# Altium schematic sheet STM32&ESP.SchDoc
size A3
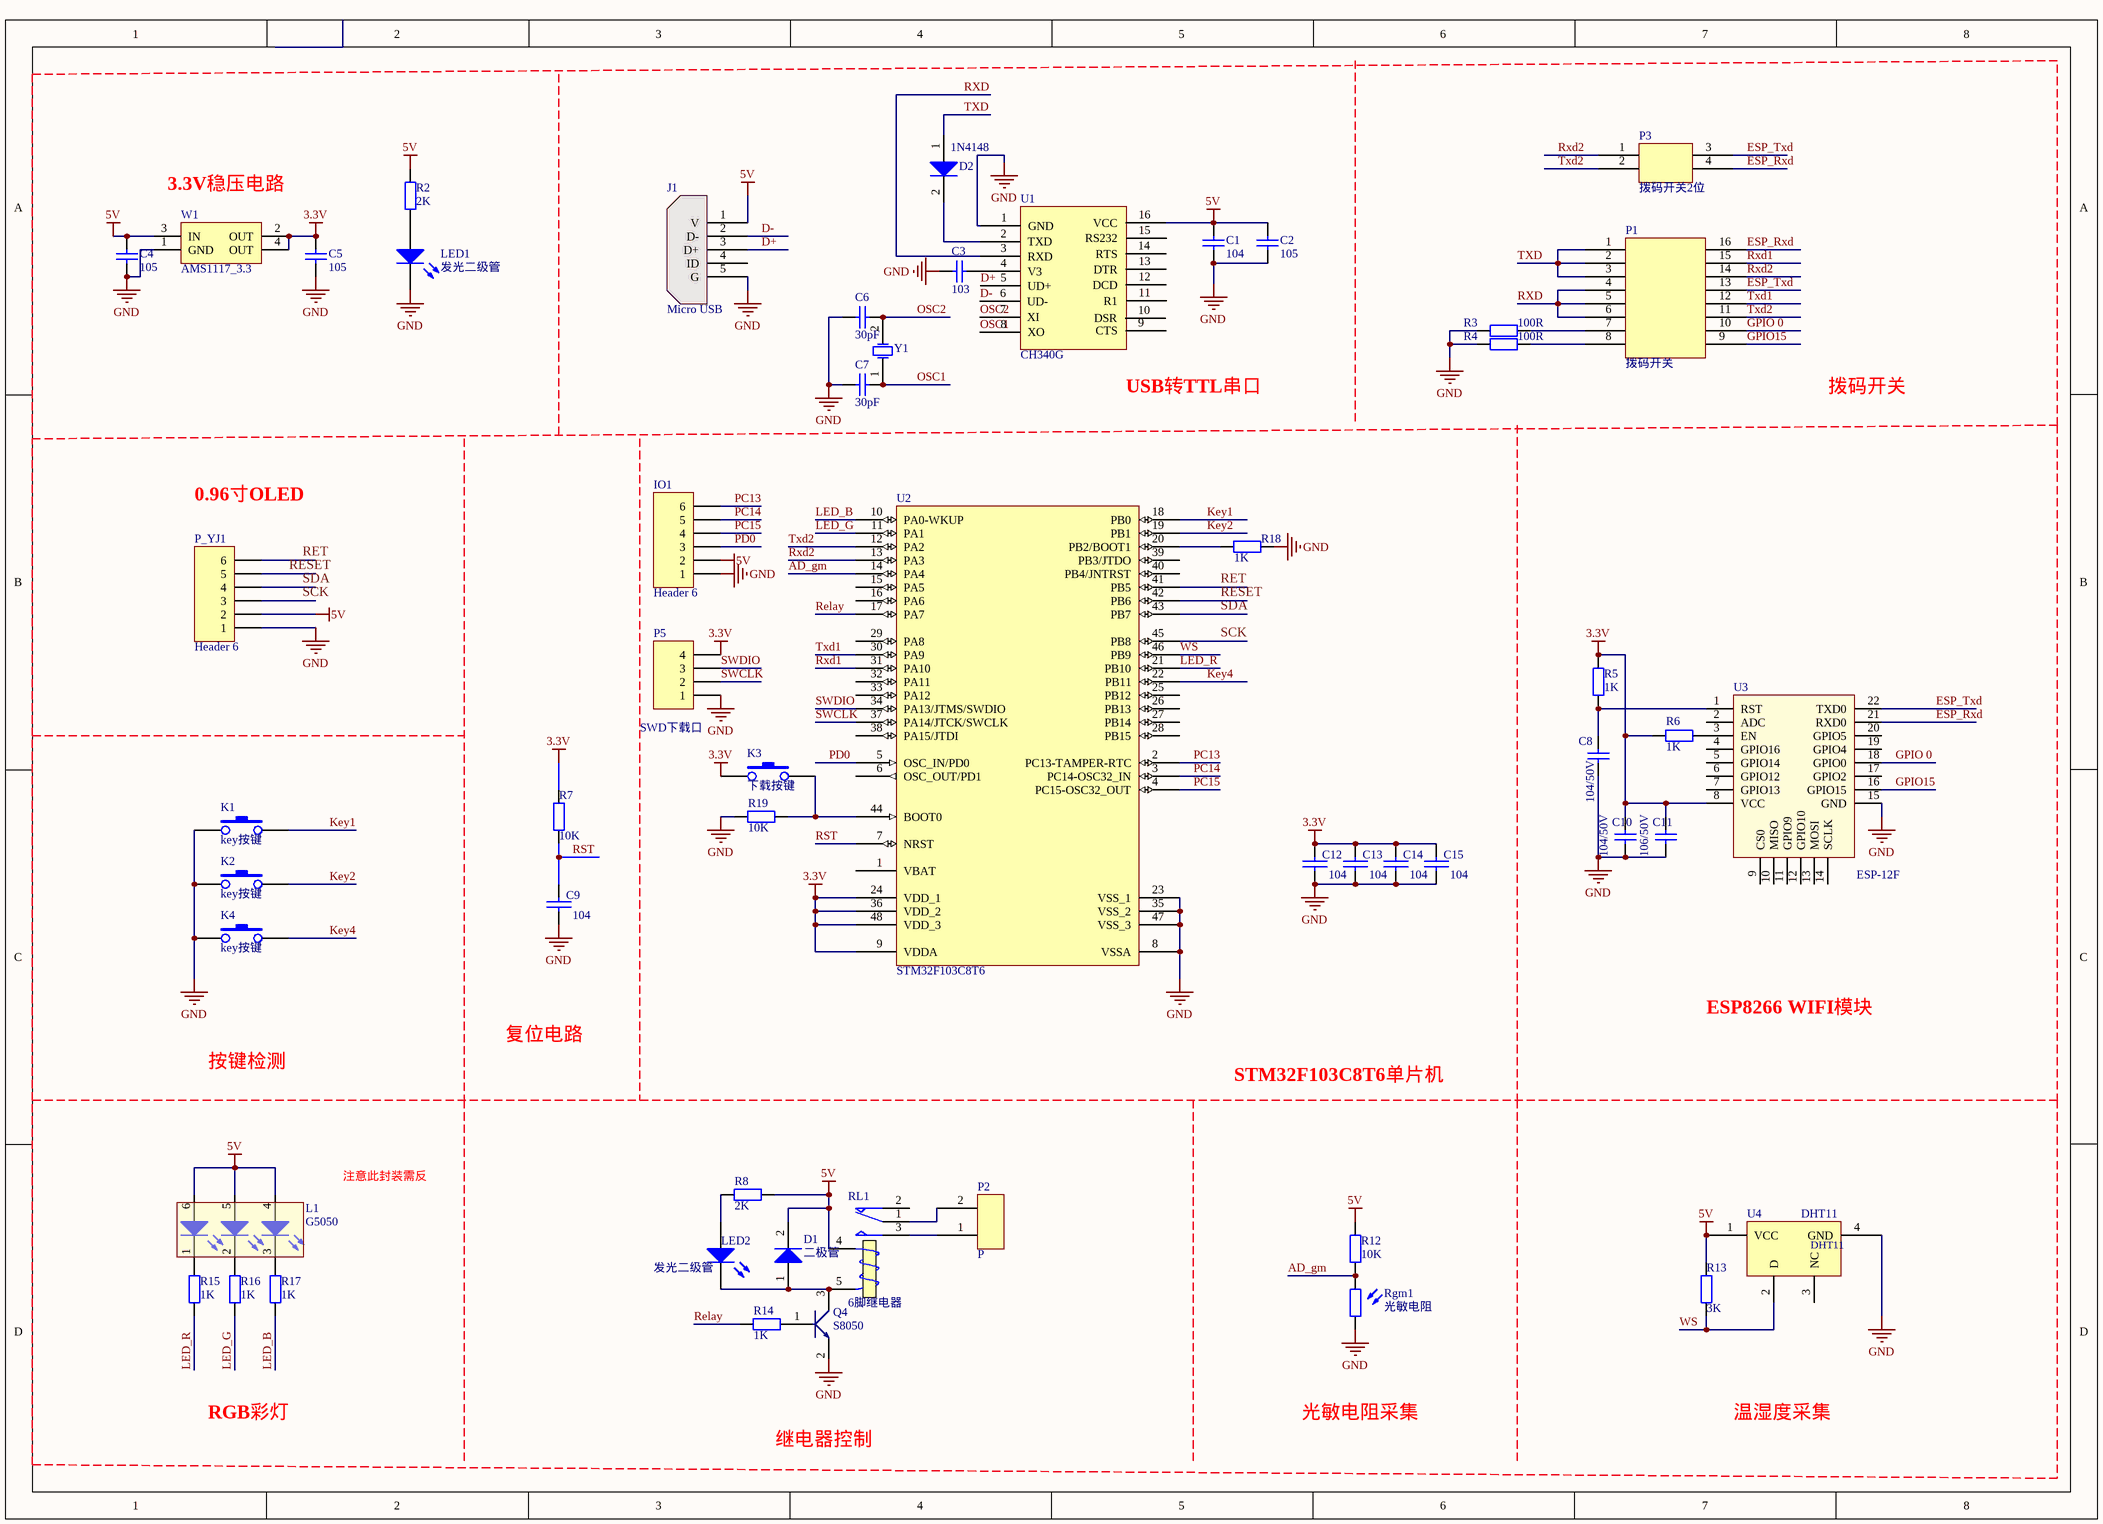
[diagram p0: STM32&ESP.SchDoc]

## Parts
C1  value 104  [SC0603]  (hidden comment: Cap)
C2  value 105  [SC0603]  (hidden comment: Cap)
C3  value 103  [SC0603]  (hidden comment: Cap)
C4  value 105  [SC0603]  (hidden comment: Cap)
C5  value 105  [SC0603]  (hidden comment: Cap)
C6  value 30pF  [SC0603]  (hidden comment: Cap)
C7  value 30pF  [SC0603]  (hidden comment: Cap)
C8  104/50V  [SC0603]
C9  104  [SC0603]
C10  104/50V  [SC0603]
C11  106/50V  [SC0603]
C12  104  [SC0603]
C13  104  [SC0603]
C14  104  [SC0603]
C15  104  [SC0603]
D1  二极管  [SS12]
D2  1N4148  [SS12]
IO1  Header 6  [HDR1X6]
J1  Micro USB  [micro usb]
K1  key按键  [SW-T]
K2  key按键  [SW-T]
K3  下载按键  [轻触开关 3*6*2.5mm]
K4  key按键  [SW-T]
L1  G5050  [G5050]
LED1  发光二级管  [G0603]
LED2  发光二级管  [G0603]
P1  拨码开关  [拨码开关]
P2  P  [KF301-2P]
P3  拨码开关2位  [拨码开关2位]
P5  SWD下载口  [4P]
P_YJ1  Header 6  [HDR1X6]
Q4  S8050  [SOT-23]
R2  2K  [0603R]
R3  100R  [0603R]
R4  100R  [0603R]
R5  1K  [0603R]
R6  1K  [0603R]
R7  1K  [0603R]  (value not drawn)
R8  2K  [0603R]
R12  10K  [0603R]
R13  1K  [0603R]  (value not drawn)
R14  1K  [0603R]
R15  1K  [0603R]
R16  1K  [0603R]
R17  1K  [0603R]
R18  1K  [0603R]
R19  10K  [0603R]
Rgm1  光敏电阻  [pr]
RL1  6脚继电器  [6脚继电器]
U1  CH340G  [MAX3232]
U2  STM32F103C8T6  [LQFP-48_M]
U3  ESP-12F  [ESP12F]
U4  DHT11  [DHT11]
W1  AMS1117_3.3  [AMS1117_3.3]
Y1  XTAL  [XTAX5]  (value not drawn)

## Nets
3.3V: C5.2 C10.1 C11.1 C12.1 C13.1 C14.1 C15.1 K3.1 P5.4 R5.2 R6.1 R7.2 U2.9(VDDA) U2.24(VDD_1) U2.36(VDD_2) U2.48(VDD_3) U3.8(VCC) W1.2(OUT) W1.4(OUT)
5V: C1.2 C2.2 C4.2 D1.2(K) IO1.2 J1.1(V) L1.4(A) L1.5(A) L1.6(A) P_YJ1.2 R2.2 R8.1 R12.2 R13.1 RL1.4(T1) U1.16(VCC) U4.1(VCC) W1.3(IN)
GND: C1.1 C2.1 C3.2 C4.1 C5.1 C6.2 C7.2 C8.2 C9.2 C10.2 C11.2 C12.2 C13.2 C14.2 C15.2 IO1.1 J1.5(G) K1.1 K2.1 K4.1 LED1.2(K) P5.1 P_YJ1.1 Q4.2 R3.1 R4.1 R18.1 R19.1 Rgm1.2 U1.1(GND) U2.8(VSSA) U2.23(VSS_1) U2.35(VSS_2) U2.47(VSS_3) U3.15(GND) U4.4(GND) W1.1(GND)
AD_gm: R12.1 Rgm1.1 U2.14(PA4)
D+: J1.3(D+) U1.5(UD+)
D-: J1.2(D-) U1.6(UD-)
ESP_Rxd: P1.16 P3.4 U3.21(RXD0)
ESP_Txd: P1.13 P3.3 U3.22(TXD0)
GPIO15: P1.9 U3.16(GPIO15)
GPIO 0: P1.10 U3.18(GPIO0)
Key1: K1.2 U2.18(PB0)
Key2: K2.2 U2.19(PB1)
Key4: K4.2 U2.22(PB11)
LED_B: R17.1 U2.10(PA0-WKUP)
LED_G: R16.1 U2.11(PA1)
LED_R: R15.1 U2.21(PB10)
OSC1: C7.1 U1.8(XO) Y1.1(OSC1)
OSC2: C6.1 U1.7(XI) Y1.2(OSC2)
PC13: IO1.6 U2.2(PC13-TAMPER-RTC)
PC14: IO1.5 U2.3(PC14-OSC32_IN)
PC15: IO1.4 U2.4(PC15-OSC32_OUT)
PD0: IO1.3 U2.5(OSC_IN/PD0)
Relay: R14.1 U2.17(PA7)
RESET: P_YJ1.5 U2.42(PB6)
RET: P_YJ1.6 U2.41(PB5)
RST: C9.1 R7.1 U2.7(NRST)
RXD: P1.4 P1.5 P1.6 U1.3(RXD)
Rxd1: P1.15 U2.31(PA10)
Rxd2: P1.14 P3.1 U2.13(PA3)
SCK: P_YJ1.3 U2.45(PB8)
SDA: P_YJ1.4 U2.43(PB7)
SWCLK: P5.2 U2.37(PA14/JTCK/SWCLK)
SWDIO: P5.3 U2.34(PA13/JTMS/SWDIO)
TXD: D2.1(A) P1.1 P1.2 P1.3
Txd1: P1.12 U2.30(PA9)
Txd2: P1.11 P3.2 U2.12(PA2)
WS: R13.2 U2.46(PB9) U4.2(D)
NetC3_1: C3.1 U1.4(V3)
NetC8_1: C8.1 R5.1 U3.1(RST)
NetD1_1: D1.1(A) LED2.2(K) Q4.3 RL1.5(T2)
NetD2_2: D2.2(K) U1.2(TXD)
NetK3_2: K3.2 R19.2 U2.44(BOOT0)
NetL1_1: L1.1(K) R15.2
NetL1_2: L1.2(K) R16.2
NetL1_3: L1.3(K) R17.2
NetLED1_1: LED1.1(A) R2.1
NetLED2_1: LED2.1(A) R8.2
NetP1_7: P1.7 R3.2
NetP1_8: P1.8 R4.2
NetP2_1: P2.1 RL1.3(NO)
NetP2_2: P2.2 RL1.1(COM)
NetQ4_1: Q4.1 R14.2
NetR6_2: R6.2 U3.3(EN)
NetR18_2: R18.2 U2.20(PB2/BOOT1)

Not connected (* = marked no-connect by the designer): J1 4(ID); RL1 2(NC); U1 9(CTS) 10(DSR) 11(R1) 12(DCD) 13(DTR) 14(RTS) 15(RS232); U2 1(VBAT) 6(OSC_OUT/PD1) 15(PA5) 16(PA6) 25(PB12) 26(PB13) 27(PB14) 28(PB15) 29(PA8) 32(PA11) 33(PA12) 38(PA15/JTDI) 39(PB3/JTDO) 40(PB4/JNTRST); U3 2(ADC) 4(GPIO16) 5(GPIO14) 6(GPIO12) 7(GPIO13) 9(CS0) 10(MISO) 11(GPIO9) 12(GPIO10) 13(MOSI) 14(SCLK) 17(GPIO2) 19(GPIO4) 20(GPIO5); U4 3(NC)

## Notes on the sheet
- (near W1) 3.3V稳压电路
- (near U1) USB转TTL串口
- 拨码开关
- 0.96寸OLED
- 按键检测
- 复位电路
- ESP8266 WIFI模块
- STM32F103C8T6单片机
- 注意此封装需反
- RGB彩灯
- 继电器控制
- 光敏电阻采集
- 温湿度采集
- (in symbol RES0.4) 10K; 3K

## Library data of the parts
C1-C7 = Cap: Capacitor; Published: 8-Jun-2000; LatestRevisionDate: 17-Jul-2002; LatestRevisionNote: Re-released for DXP Platform.; Publisher: Altium Limited
C8 C10 C11 = Cap Semi: Capacitor (Semiconductor SIM Model); Manufacturer: 风华高科; Price: 0.01
  C8 C10: Value: 104/50V
  C11: Value: 106/50V
C9 C12-C15 = CAP: Capacitor
D2 = 二极管
IO1 P_YJ1 = Header 6: Header, 6-Pin; LatestRevisionDate: 17-Jul-2002; LatestRevisionNote: Re-released for DXP Platform.; Publisher: Altium Limited
K3 = key按键
P2 = 2P
P5 = 4P
Q4 = 三极管3
R2 R8 = 电阻R
R3-R6 R12 R14-R19 = RES0.2: Manufacturer: 厚生; Price: 0.01
  R3 R4: Value: 100R
  R5 R6 R14-R18: Value: 1K
  R12 R19: Value: 10K
R7 R13 = RES0.4
Rgm1 = Res-Sen
U3 = ESP-12F: Manufacturer: 安信可; Price: 12.27; Value: ESP-12F
Y1 = XTAL: Crystal Oscillator; Published: 8-Jun-2000; LatestRevisionDate: 17-Jul-2002; LatestRevisionNote: Re-released for DXP Platform.; PackageReference: R38; Publisher: Altium Limited